# Altium schematic sheet Revisions.SchDoc: Olimex Interface Board
size A4; CompanyName: Ultimaker B.V.; DrawnBy: Coen de Boer; Engineer: Coen de Boer; Revision: 2005-H
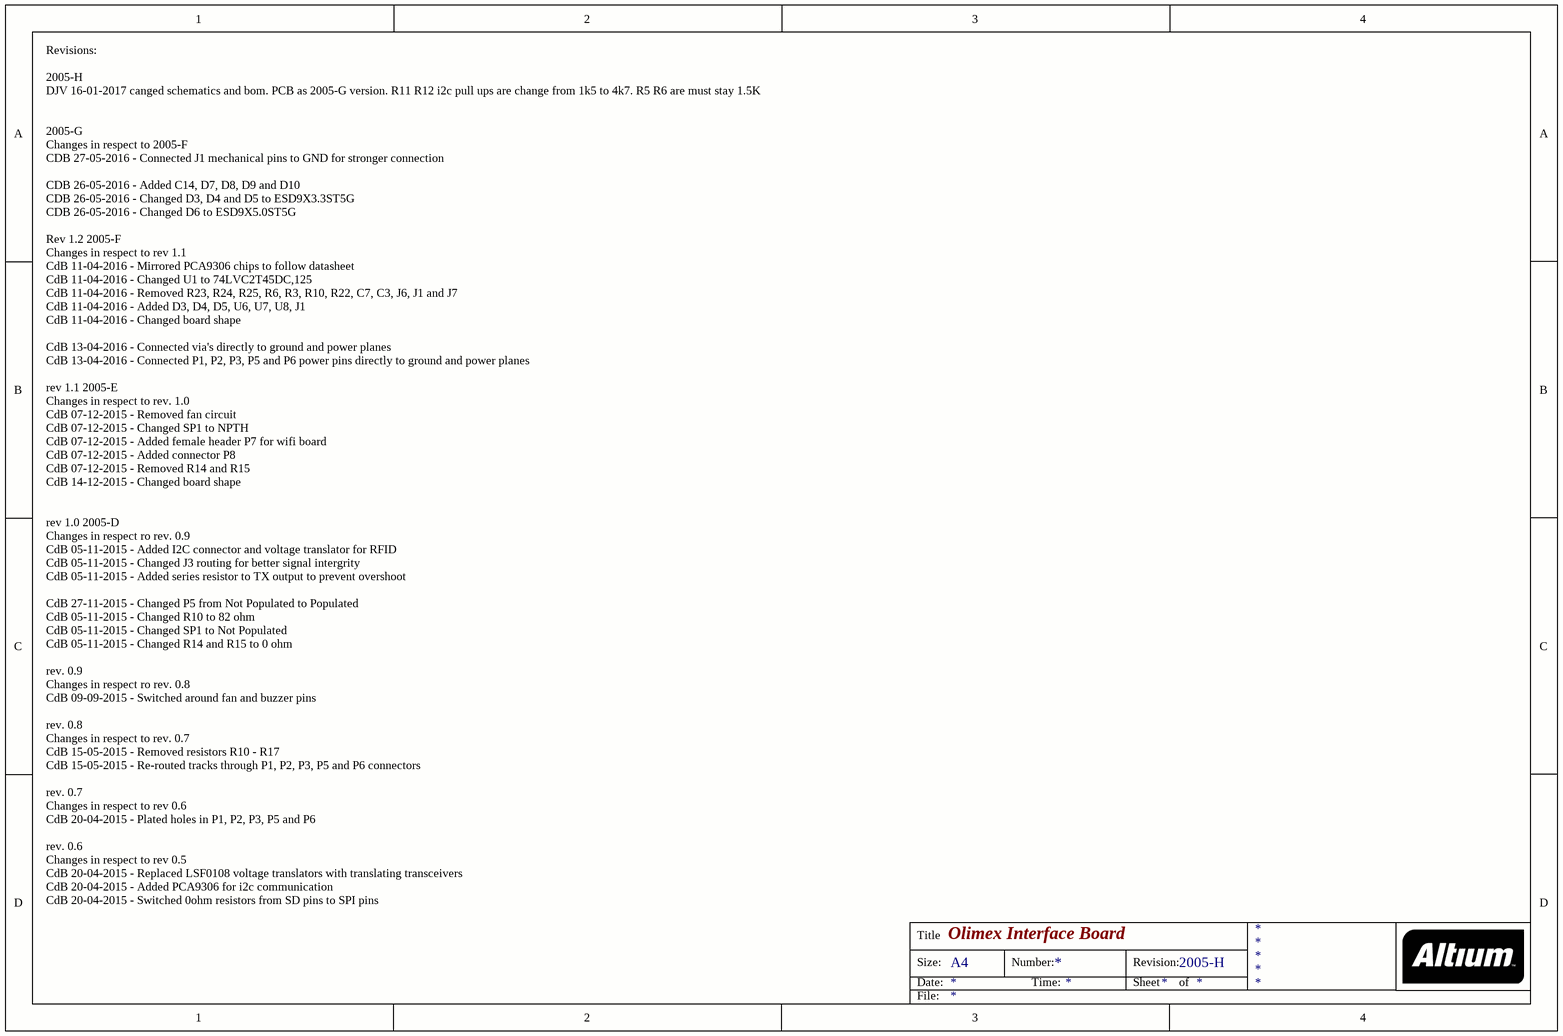
[diagram p0: Revisions.SchDoc]

## Notes on the sheet
- Revisions:
  2005-H
  DJV 16-01-2017 canged schematics and bom. PCB as 2005-G version. R11 R12 i2c pull ups are change from 1k5 to 4k7. R5 R6 are must stay 1.5K
  2005-G
  Changes in respect to 2005-F
  CDB 27-05-2016 - Connected J1 mechanical pins to GND for stronger connection
  CDB 26-05-2016 - Added C14, D7, D8, D9 and D10
  CDB 26-05-2016 - Changed D3, D4 and D5 to ESD9X3.3ST5G
  CDB 26-05-2016 - Changed D6 to ESD9X5.0ST5G
  Rev 1.2 2005-F
  Changes in respect to rev 1.1
  CdB 11-04-2016 - Mirrored PCA9306 chips to follow datasheet
  CdB 11-04-2016 - Changed U1 to 74LVC2T45DC,125
  CdB 11-04-2016 - Removed R23, R24, R25, R6, R3, R10, R22, C7, C3, J6, J1 and J7
  CdB 11-04-2016 - Added D3, D4, D5, U6, U7, U8, J1
  CdB 11-04-2016 - Changed board shape
  CdB 13-04-2016 - Connected via's directly to ground and power planes
  CdB 13-04-2016 - Connected P1, P2, P3, P5 and P6 power pins directly to ground and power planes
  rev 1.1 2005-E
  Changes in respect to rev. 1.0
  CdB 07-12-2015 - Removed fan circuit
  CdB 07-12-2015 - Changed SP1 to NPTH
  CdB 07-12-2015 - Added female header P7 for wifi board
  CdB 07-12-2015 - Added connector P8
  CdB 07-12-2015 - Removed R14 and R15
  CdB 14-12-2015 - Changed board shape
  rev 1.0 2005-D
  Changes in respect ro rev. 0.9
  CdB 05-11-2015 - Added I2C connector and voltage translator for RFID
  CdB 05-11-2015 - Changed J3 routing for better signal intergrity
  CdB 05-11-2015 - Added series resistor to TX output to prevent overshoot
  CdB 27-11-2015 - Changed P5 from Not Populated to Populated
  CdB 05-11-2015 - Changed R10 to 82 ohm
  CdB 05-11-2015 - Changed SP1 to Not Populated
  CdB 05-11-2015 - Changed R14 and R15 to 0 ohm
  rev. 0.9
  Changes in respect ro rev. 0.8
  CdB 09-09-2015 - Switched around fan and buzzer pins
  rev. 0.8
  Changes in respect to rev. 0.7
  CdB 15-05-2015 - Removed resistors R10 - R17
  CdB 15-05-2015 - Re-routed tracks through P1, P2, P3, P5 and P6 connectors
  rev. 0.7
  Changes in respect to rev 0.6
  CdB 20-04-2015 - Plated holes in P1, P2, P3, P5 and P6
  rev. 0.6
  Changes in respect to rev 0.5
  CdB 20-04-2015 - Replaced LSF0108 voltage translators with translating transceivers
  CdB 20-04-2015 - Added PCA9306 for i2c communication
  CdB 20-04-2015 - Switched 0ohm resistors from SD pins to SPI pins
  CdB 20-04-2015 - Added resistors in series to non used pins to Ulticontroller
  CdB 20-04-2015 - Moved SD-card detect to interrupt pin
- Title
- Size:
- Date:
- A4
- Number:
- Time:
- Revision:
- Sheet
- of
- File: